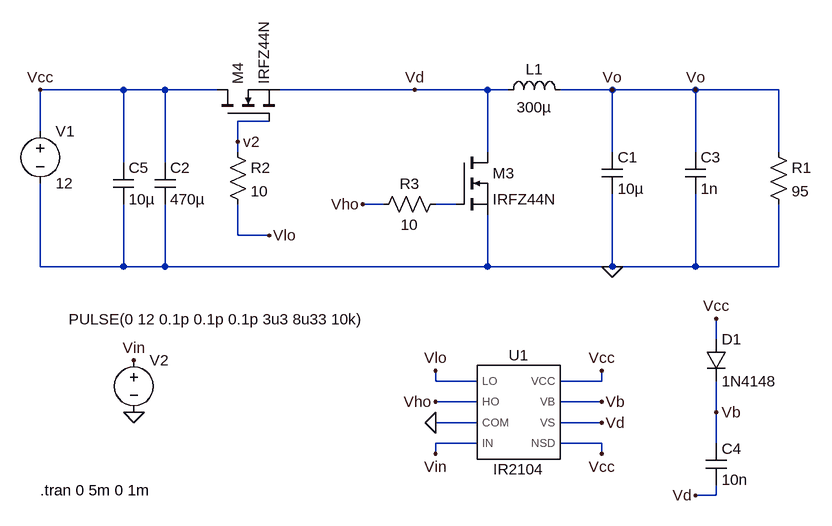
[diagram p0: schematic buck_drivers.asc]
buck_drivers.asc, the LTspice schematic file:
Version 4
SHEET 1 1388 732
WIRE 96 48 -32 48
WIRE 160 48 96 48
WIRE 240 48 160 48
WIRE 544 48 336 48
WIRE 656 48 544 48
WIRE 688 48 656 48
WIRE 848 48 768 48
WIRE 976 48 848 48
WIRE 1104 48 976 48
WIRE 320 96 272 96
WIRE -32 112 -32 48
WIRE 272 128 272 96
WIRE 272 144 272 128
WIRE 656 144 656 48
WIRE 848 144 848 48
WIRE 976 144 976 48
WIRE 1104 144 1104 48
WIRE 96 160 96 48
WIRE 160 160 160 48
WIRE 496 224 464 224
WIRE 608 224 576 224
WIRE 272 272 272 224
WIRE 320 272 272 272
WIRE -32 320 -32 192
WIRE 96 320 96 224
WIRE 96 320 -32 320
WIRE 160 320 160 224
WIRE 160 320 96 320
WIRE 656 320 656 240
WIRE 656 320 160 320
WIRE 848 320 848 208
WIRE 848 320 656 320
WIRE 976 320 976 208
WIRE 976 320 848 320
WIRE 1104 320 1104 224
WIRE 1104 320 976 320
WIRE 1008 432 1008 400
WIRE 576 496 576 480
WIRE 640 496 576 496
WIRE 832 496 832 480
WIRE 832 496 768 496
WIRE 640 528 576 528
WIRE 832 528 768 528
WIRE 1008 544 1008 496
WIRE 640 560 576 560
WIRE 832 560 768 560
WIRE 640 592 576 592
WIRE 832 592 768 592
WIRE 1008 592 1008 544
WIRE 576 608 576 592
WIRE 832 608 832 592
WIRE 1008 672 1008 656
WIRE 1008 672 976 672
FLAG 848 320 0
FLAG 848 48 Vo
FLAG 544 48 Vd
FLAG 272 128 v2
FLAG 976 48 Vo
FLAG 576 560 0
FLAG 576 480 Vlo
FLAG 576 608 Vin
FLAG -32 48 Vcc
FLAG 832 480 Vcc
FLAG 576 528 Vho
FLAG 464 224 Vho
FLAG 320 272 Vlo
FLAG 112 464 Vin
FLAG 112 544 0
FLAG 1008 400 Vcc
FLAG 976 672 Vd
FLAG 832 528 Vb
FLAG 1008 544 Vb
FLAG 832 560 Vd
FLAG 832 608 Vcc
SYMBOL voltage -32 96 R0
WINDOW 123 0 0 Left 0
WINDOW 39 0 0 Left 0
SYMATTR InstName V1
SYMATTR Value 12
SYMBOL ind 672 64 R270
WINDOW 0 32 56 VTop 2
WINDOW 3 5 56 VBottom 2
SYMATTR InstName L1
SYMATTR Value 300µ
SYMBOL cap 832 144 R0
SYMATTR InstName C1
SYMATTR Value 10µ
SYMBOL res 1088 128 R0
SYMATTR InstName R1
SYMATTR Value 95
SYMBOL nmos 608 144 R0
SYMATTR InstName M3
SYMATTR Value IRFZ44N
SYMBOL nmos 240 96 R270
SYMATTR InstName M4
SYMATTR Value IRFZ44N
SYMBOL res 256 128 R0
SYMATTR InstName R2
SYMATTR Value 10
SYMBOL cap 144 160 R0
SYMATTR InstName C2
SYMATTR Value 470µ
SYMBOL cap 960 144 R0
SYMATTR InstName C3
SYMATTR Value 1n
SYMBOL res 592 208 R90
WINDOW 0 0 56 VBottom 2
WINDOW 3 32 56 VTop 2
SYMATTR InstName R3
SYMATTR Value 10
SYMBOL voltage 112 448 R0
WINDOW 3 -100 -47 Left 2
WINDOW 123 0 0 Left 0
WINDOW 39 0 0 Left 0
SYMATTR Value PULSE(0 12 0.1p 0.1p 0.1p 3u3 8u33 10k)
SYMATTR InstName V2
SYMBOL diode 992 432 R0
SYMATTR InstName D1
SYMATTR Value 1N4148
SYMBOL cap 992 592 R0
SYMATTR InstName C4
SYMATTR Value 10n
SYMBOL IR2104 704 544 R0
SYMATTR InstName U1
SYMBOL cap 80 160 R0
SYMATTR InstName C5
SYMATTR Value 10µ
TEXT -32 664 Left 2 !.tran 0 5m 0 1m

The netlist it stands for:
* buck_drivers.asc
V1 Vcc 0 12
L1 Vd Vo 300µ
C1 Vo 0 10µ
R1 Vo 0 95
M3 Vd N001 0 0 IRFZ44N
M4 Vcc v2 Vd Vd IRFZ44N
R2 v2 Vlo 10
C2 Vcc 0 470µ
C3 Vo 0 1n
R3 N001 Vho 10
V2 Vin 0 PULSE(0 12 0.1p 0.1p 0.1p 3u3 8u33 10k)
D1 Vcc Vb 1N4148
C4 Vb Vd 10n
XU1 Vlo Vho 0 Vin Vcc Vb Vd Vcc IR2104  ; pins LO HO COM IN VCC VB VS NSD
C5 Vcc 0 10µ
.model D D
.lib standard.dio
.model NMOS NMOS
.model PMOS PMOS
.lib standard.mos
.tran 0 5m 0 1m
.lib C:\Users\mathe\Documents\Ing. Electronica\1C 2025\C2\IR2104.lib
.backanno
.end